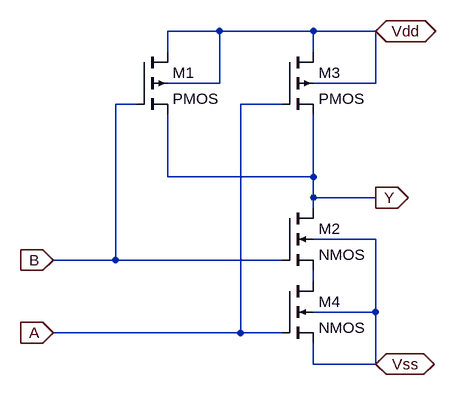
[diagram p0: schematic nand1.asc]
nand1.asc, the LTspice schematic file:
Version 4
SHEET 1 880 680
WIRE 0 -48 -80 -48
WIRE 144 -48 0 -48
WIRE 240 -48 144 -48
WIRE -80 -16 -80 -48
WIRE 144 -16 144 -48
WIRE 0 32 0 -48
WIRE 0 32 -80 32
WIRE 240 32 240 -48
WIRE 240 32 144 32
WIRE -128 64 -160 64
WIRE 96 64 32 64
WIRE -80 176 -80 80
WIRE 144 176 144 80
WIRE 144 176 -80 176
WIRE 144 208 144 176
WIRE 240 208 144 208
WIRE 144 224 144 208
WIRE 240 272 144 272
WIRE -160 304 -160 64
WIRE -160 304 -256 304
WIRE 96 304 -160 304
WIRE 144 336 144 320
WIRE 240 384 240 272
WIRE 240 384 144 384
WIRE 32 416 32 64
WIRE 32 416 -256 416
WIRE 96 416 32 416
WIRE 144 464 144 432
WIRE 240 464 240 384
WIRE 240 464 144 464
FLAG 240 -48 Vdd
IOPIN 240 -48 BiDir
FLAG 240 464 Vss
IOPIN 240 464 BiDir
FLAG -256 416 A
IOPIN -256 416 In
FLAG 240 208 Y
IOPIN 240 208 Out
FLAG -256 304 B
IOPIN -256 304 In
SYMBOL pmos4 -128 -16 R0
SYMATTR InstName M1
SYMATTR Value2 l=0.2u w=1u ad=0.5p as=0.5p
SYMBOL nmos4 96 224 R0
SYMATTR InstName M2
SYMATTR Value2 l=0.2u w=1u ad=0.5p as=0.5p
SYMBOL pmos4 96 -16 R0
SYMATTR InstName M3
SYMATTR Value2 l=0.2u w=1u ad=0.5p as=0.5p
SYMBOL nmos4 96 336 R0
SYMATTR InstName M4
SYMATTR Value2 l=0.2u w=1u ad=0.5p as=0.5p

The netlist it stands for:
* nand1.asc
M1 Vdd B Y Vdd PMOS l=0.2u w=1u ad=0.5p as=0.5p
M2 Y B N001 Vss NMOS l=0.2u w=1u ad=0.5p as=0.5p
M3 Vdd A Y Vdd PMOS l=0.2u w=1u ad=0.5p as=0.5p
M4 N001 A Vss Vss NMOS l=0.2u w=1u ad=0.5p as=0.5p
.model NMOS NMOS
.model PMOS PMOS
.lib standard.mos
.backanno
.end